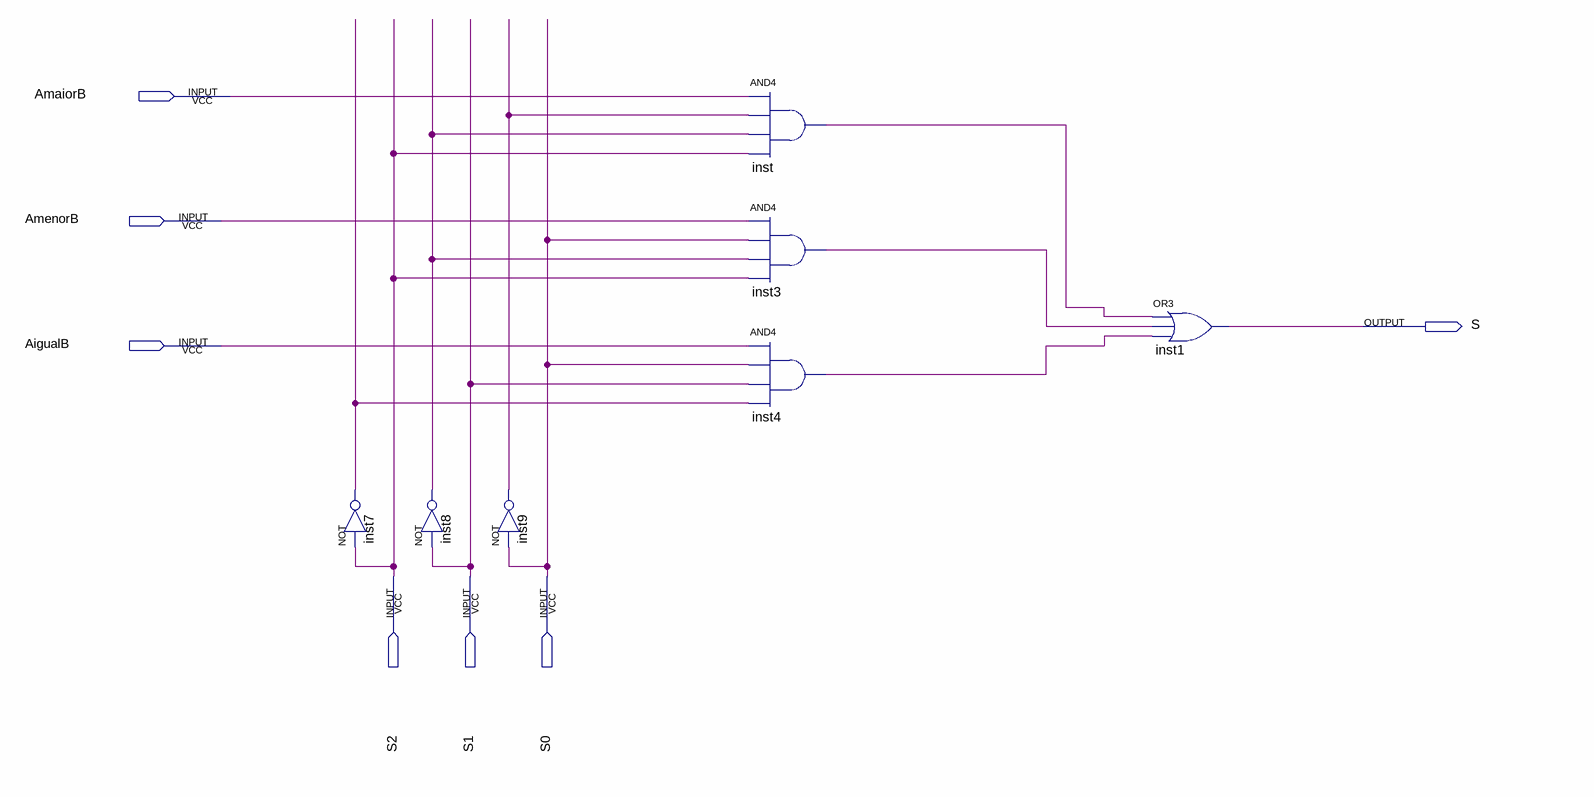
[diagram p0: schematic sheet]
// Quartus schematic MUXCOMP.bdf as structural Verilog: 7 symbols, 7 pins
module MUXCOMP (
  input  AmaiorB,
  input  AmenorB,
  input  AigualB,
  input  S2,
  input  S1,
  input  S0,
  output S
);

  wire inst3_out, inst4_out, inst7_out, inst8_out, inst9_out, inst_out;

  not inst7 (inst7_out, S2);
  not inst8 (inst8_out, S1);
  not inst9 (inst9_out, S0);
  and inst (inst_out, AmaiorB, inst9_out, inst8_out, S2);
  and inst3 (inst3_out, AmenorB, S0, inst8_out, S2);
  and inst4 (inst4_out, AigualB, S0, S1, inst7_out);
  or inst1 (S, inst_out, inst3_out, inst4_out);
endmodule
